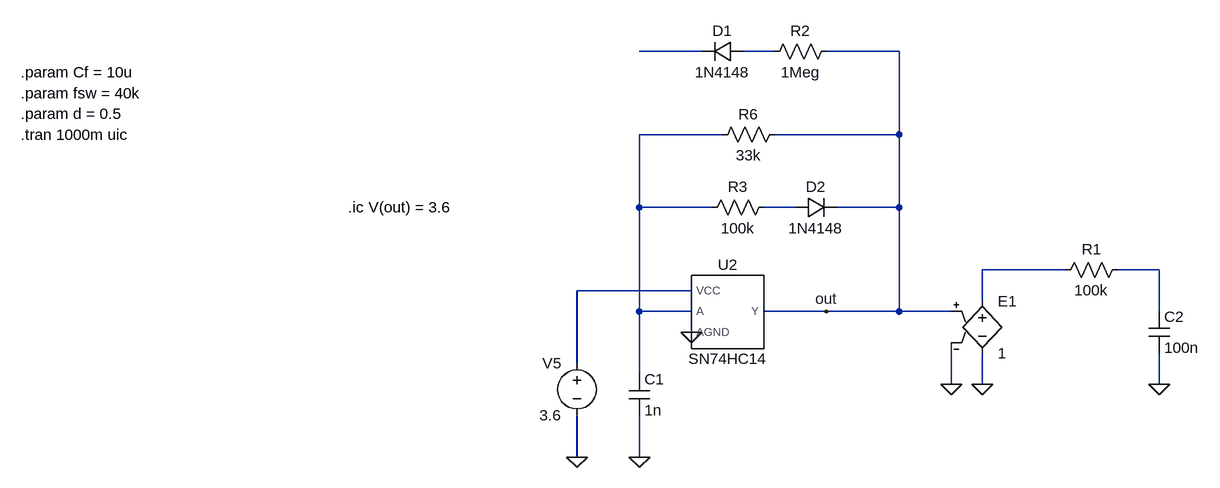
[diagram p0: schematic logicoscilator.asc]
logicoscilator.asc, the LTspice schematic file:
Version 4
SHEET 1 11460 3748
WIRE 48 816 -48 816
WIRE 160 816 112 816
WIRE 352 816 240 816
WIRE 80 944 -48 944
WIRE 352 944 352 816
WIRE 352 944 160 944
WIRE -48 1056 -48 944
WIRE 64 1056 -48 1056
WIRE 192 1056 144 1056
WIRE 352 1056 352 944
WIRE 352 1056 256 1056
WIRE 608 1152 480 1152
WIRE 752 1152 688 1152
WIRE 32 1184 -144 1184
WIRE 480 1200 480 1152
WIRE -48 1216 -48 1056
WIRE 32 1216 -48 1216
WIRE 240 1216 144 1216
WIRE 352 1216 352 1056
WIRE 352 1216 240 1216
WIRE 432 1216 352 1216
WIRE 752 1216 752 1152
WIRE -144 1296 -144 1184
WIRE -48 1312 -48 1216
WIRE 432 1328 432 1264
WIRE 480 1328 480 1280
WIRE 752 1328 752 1280
WIRE -144 1440 -144 1376
WIRE -48 1440 -48 1376
FLAG -144 1440 0
FLAG -48 1440 0
FLAG 32 1248 0
FLAG 240 1216 out
FLAG 752 1328 0
FLAG 480 1328 0
FLAG 432 1328 0
SYMBOL voltage -144 1280 M0
WINDOW 123 0 0 Left 0
WINDOW 39 0 0 Left 0
SYMATTR InstName V5
SYMATTR Value 3.6
SYMBOL SN74HC14 80 1200 R0
SYMATTR InstName U2
SYMBOL res 176 928 R90
WINDOW 0 0 56 VBottom 2
WINDOW 3 32 56 VTop 2
SYMATTR InstName R6
SYMATTR Value 33k
SYMBOL cap -64 1312 R0
SYMATTR InstName C1
SYMATTR Value 1n
SYMBOL e 480 1184 R0
SYMATTR InstName E1
SYMATTR Value 1
SYMBOL res 704 1136 R90
WINDOW 0 0 56 VBottom 2
WINDOW 3 32 56 VTop 2
SYMATTR InstName R1
SYMATTR Value 100k
SYMBOL cap 736 1216 R0
SYMATTR InstName C2
SYMATTR Value 100n
SYMBOL diode 112 800 R90
WINDOW 0 0 32 VBottom 2
WINDOW 3 32 32 VTop 2
SYMATTR InstName D1
SYMATTR Value 1N4148
SYMBOL res 256 800 R90
WINDOW 0 0 56 VBottom 2
WINDOW 3 32 56 VTop 2
SYMATTR InstName R2
SYMATTR Value 1Meg
SYMBOL diode 192 1072 R270
WINDOW 0 32 32 VTop 2
WINDOW 3 0 32 VBottom 2
SYMATTR InstName D2
SYMATTR Value 1N4148
SYMBOL res 48 1072 R270
WINDOW 0 32 56 VTop 2
WINDOW 3 0 56 VBottom 2
SYMATTR InstName R3
SYMATTR Value 100k
TEXT -1000 880 Left 2 !.param fsw = 40k
TEXT -1000 912 Left 2 !.param d = 0.5
TEXT -1000 848 Left 2 !.param Cf = 10u
TEXT -1000 944 Left 2 !.tran 1000m uic
TEXT -496 1056 Left 2 !.ic V(out) = 3.6

The netlist it stands for:
* logicoscilator.asc
V5 N007 0 3.6
XU2 out N003 N007 0 SN74HC14  ; pins Y A VCC AGND
R6 out N003 33k
C1 N003 0 1n
E1 N005 0 out 0 1
R1 N006 N005 100k
C2 N006 0 100n
D1 N002 N001 1N4148
R2 out N002 1Meg
D2 N004 out 1N4148
R3 N003 N004 100k
.model D D
.lib standard.dio
.param fsw = 40k
.param d = 0.5
.param Cf = 10u
.tran 1000m uic
.ic V(out) = 3.6
.lib SN74HC14.cir
.backanno
.end